# Altium schematic sheet eDP.SchDoc
size B
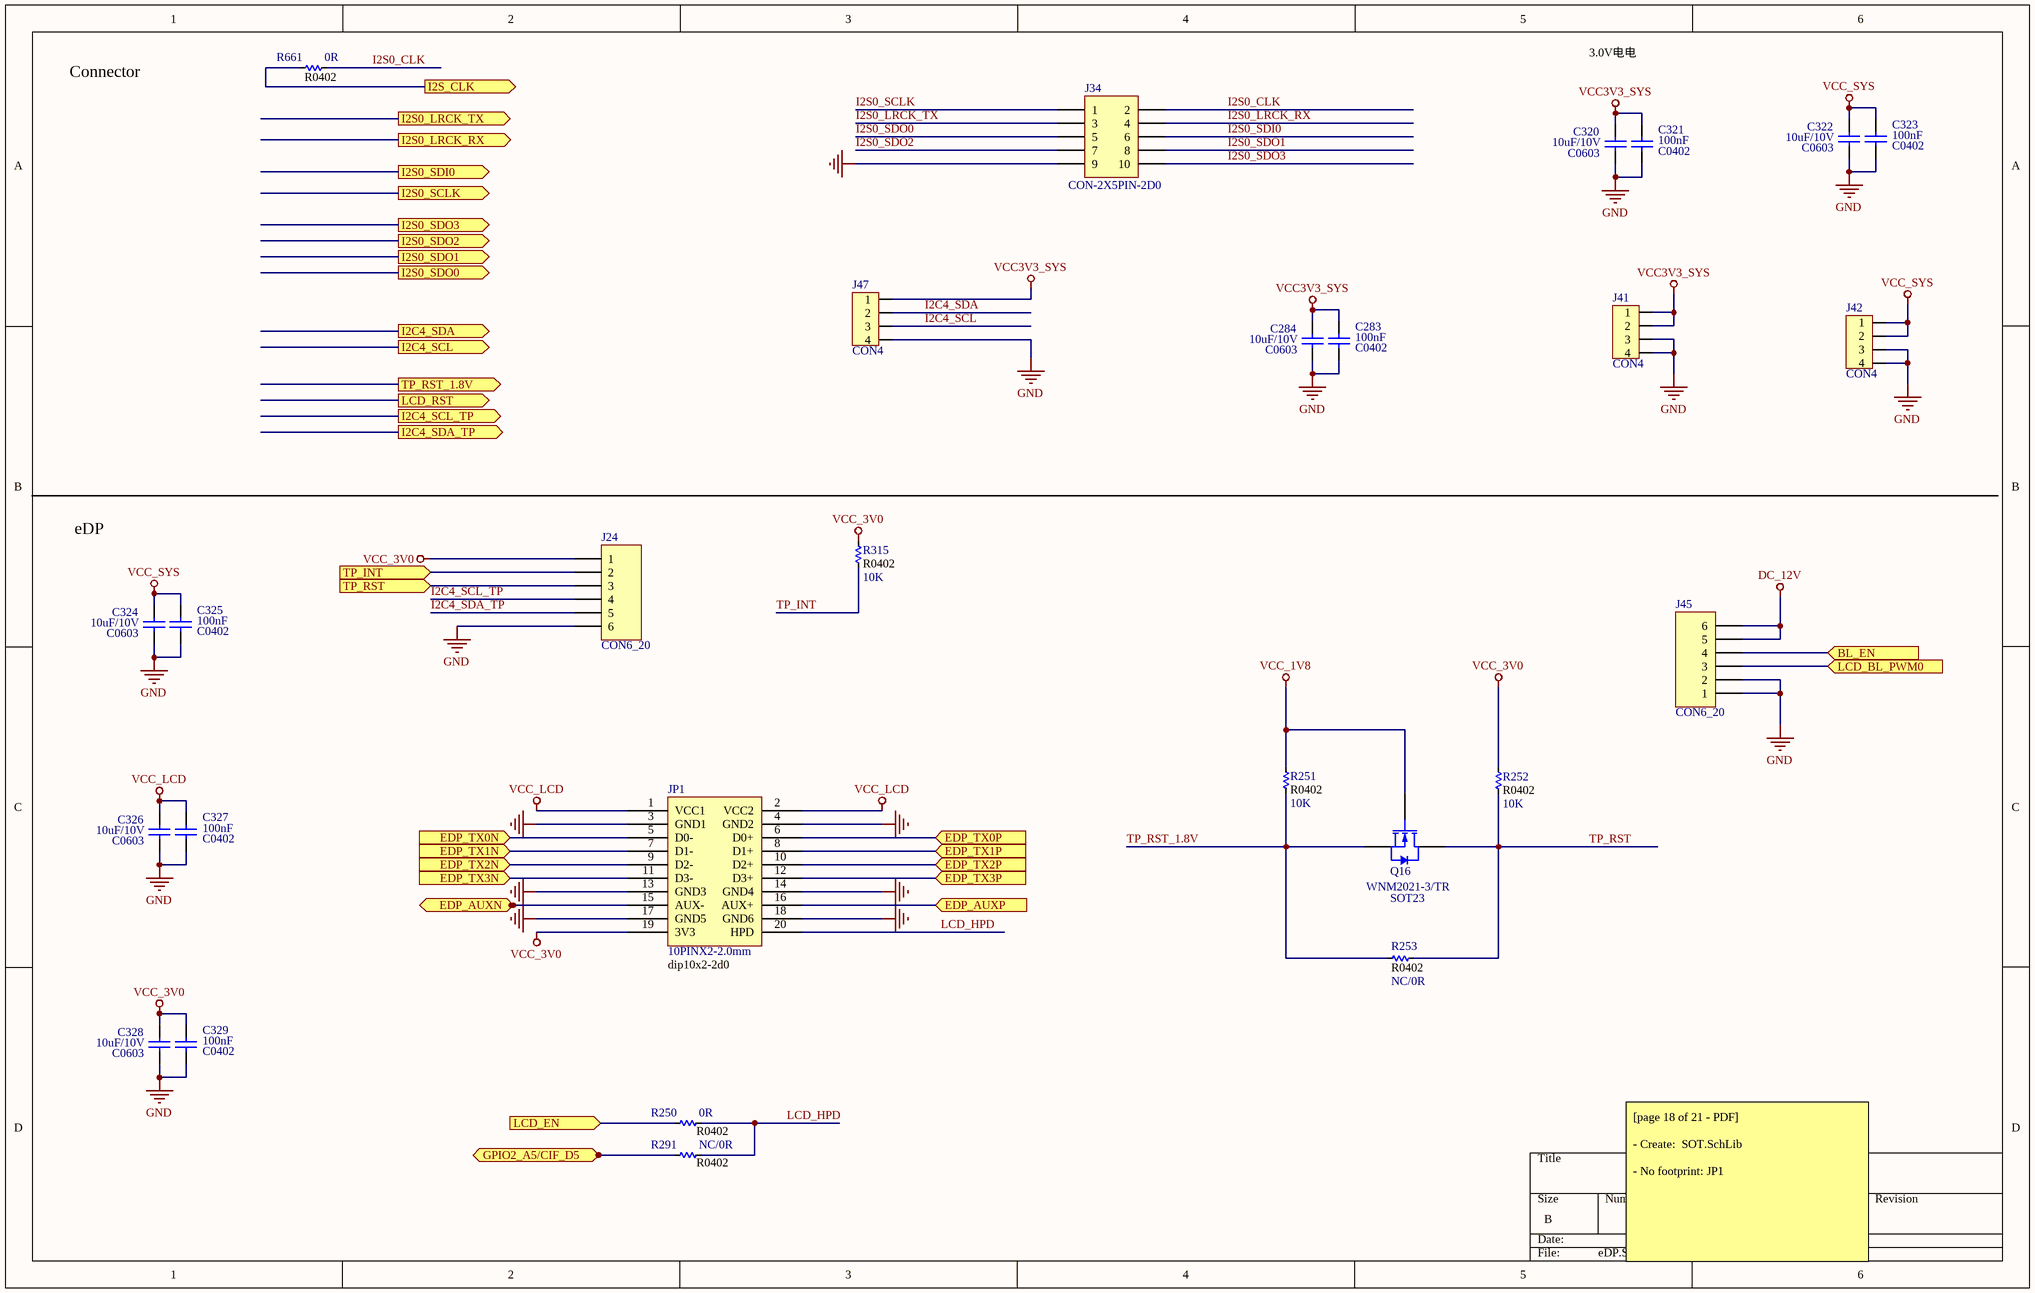
[diagram p0: eDP.SchDoc]

## Parts
C283  C0402  value 100nF  [C 0402]
C284  C0603  value 10uF/10V  [C 0603]
C320  C0603  value 10uF/10V  [C 0603]
C321  C0402  value 100nF  [C 0402]
C322  C0603  value 10uF/10V  [C 0603]
C323  C0402  value 100nF  [C 0402]
C324  C0603  value 10uF/10V  [C 0603]
C325  C0402  value 100nF  [C 0402]
C326  C0603  value 10uF/10V  [C 0603]
C327  C0402  value 100nF  [C 0402]
C328  C0603  value 10uF/10V  [C 0603]
C329  C0402  value 100nF  [C 0402]
J24  CON6_20  [Header6]
J34  CON-2X5PIN-2D0  [Hed2X5]
J41  CON4  [CON4]
J42  CON4  [CON4]
J45  CON6_20  [Header6]
J47  CON4  [CON4]
JP1  10PINX2-2.0mm  [JP10-D2T]
Q16  WNM2021-3/TR  [SOT23]
R250  R0402  value 0R  [R 0402]
R251  R0402  value 10K  [R 0402]
R252  R0402  value 10K  [R 0402]
R253  R0402  value NC/0R  [R 0402]
R291  R0402  value NC/0R  [R 0402]
R315  R0402  value 10K  [R 0402]
R661  R0402  value 0R  [R 0402]

## Ports
BL_EN (in), EDP_AUXN (in), EDP_AUXP (in), EDP_TX0N (in), EDP_TX0P (in), EDP_TX1N (in), EDP_TX1P (in), EDP_TX2N (in), EDP_TX2P (in), EDP_TX3N (in), EDP_TX3P (in), GPIO2_A5/CIF_D5 (in), I2C4_SCL (out), I2C4_SCL_TP (out), I2C4_SDA (out), I2C4_SDA_TP (out), I2S0_LRCK_RX (out), I2S0_LRCK_TX (out), I2S0_SCLK (out), I2S0_SDI0 (out), I2S0_SDO0 (out), I2S0_SDO1 (out), I2S0_SDO2 (out), I2S0_SDO3 (out), I2S_CLK (out), LCD_BL_PWM0 (in), LCD_EN (in), LCD_RST (out), TP_INT (in), TP_RST (in), TP_RST_1.8V (out)

## Nets
DC_12V: J45.5 J45.6
GND: C283.2 C284.2 C320.2 C321.2 C322.2 C323.2 C324.2 C325.2 C326.2 C327.2 C328.2 C329.2 J24.6 J34.9 J41.3 J41.4 J42.3 J42.4 J45.1 J45.2 J47.4 JP1.3(GND1) JP1.4(GND2) JP1.13(GND3) JP1.14(GND4) JP1.17(GND5) JP1.18(GND6)
VCC3V3_SYS: C283.1 C284.1 C320.1 C321.1 J41.1 J41.2 J47.1
VCC_1V8: Q16.3(G) R251.2
VCC_3V0: C328.1 C329.1 J24.1 JP1.19(3V3) R252.2 R315.2
VCC_LCD: C326.1 C327.1 JP1.1(VCC1) JP1.2(VCC2)
VCC_SYS: C322.1 C323.1 C324.1 C325.1 J42.1 J42.2
BL_EN: J45.4 ; port BL_EN
EDP_AUXN: JP1.15(AUX-) ; port EDP_AUXN
EDP_AUXP: JP1.16(AUX+) ; port EDP_AUXP
EDP_TX0N: JP1.5(D0-) ; port EDP_TX0N
EDP_TX0P: JP1.6(D0+) ; port EDP_TX0P
EDP_TX1N: JP1.7(D1-) ; port EDP_TX1N
EDP_TX1P: JP1.8(D1+) ; port EDP_TX1P
EDP_TX2N: JP1.9(D2-) ; port EDP_TX2N
EDP_TX2P: JP1.10(D2+) ; port EDP_TX2P
EDP_TX3N: JP1.11(D3-) ; port EDP_TX3N
EDP_TX3P: JP1.12(D3+) ; port EDP_TX3P
GPIO2_A5/CIF_D5: R291.1 ; port GPIO2_A5/CIF_D5
I2C4_SCL: J47.3
I2C4_SCL_TP: J24.4
I2C4_SDA: J47.2
I2C4_SDA_TP: J24.5
I2S0_CLK: J34.2 R661.2
I2S0_LRCK_RX: J34.4
I2S0_LRCK_TX: J34.3
I2S0_SCLK: J34.1
I2S0_SDI0: J34.6
I2S0_SDO0: J34.5
I2S0_SDO1: J34.8
I2S0_SDO2: J34.7
I2S0_SDO3: J34.10
I2S_CLK: R661.1 ; port I2S_CLK
LCD_BL_PWM0: J45.3 ; port LCD_BL_PWM0
LCD_EN: R250.1 ; port LCD_EN
LCD_HPD: JP1.20(HPD) R250.2 R291.2
TP_INT: J24.2 ; port TP_INT
TP_INT: R315.1  [a separate net that carries the same name]
TP_RST: J24.3 ; port TP_RST
TP_RST: Q16.1(D) R252.1 R253.1  [a separate net that carries the same name]
TP_RST_1.8V: Q16.2(S) R251.1 R253.2

## Notes on the sheet
- Connector
- 3.0V电电
- eDP
- [page 18 of 21 - PDF]
  - Create:  SOT.SchLib
  - No footprint: JP1
- (in symbol 10PINX2-2.0mm) dip10x2-2d0

## Library data of the parts
C283 C284 C320-C329 = Cap: Capacitor; Published: 8-Jun-2000; LatestRevisionDate: 17-Jul-2002; LatestRevisionNote: Re-released for DXP Platform.; PackageReference: RAD-0.3; Publisher: Altium Limited; PackageDescription: Radial Cap, Thru-Hole; 2 Leads; 0.3 in Pin Spacing
J24 J45 = Header 6: Header, 6-Pin; LatestRevisionDate: 17-Jul-2002; LatestRevisionNote: Re-released for DXP Platform.; Publisher: Altium Limited
J34 = Header 5X2: Header, 5-Pin, Dual row; LatestRevisionDate: 17-Jul-2002; LatestRevisionNote: Re-released for DXP Platform.; Publisher: Altium Limited
J41 J42 J47 = Header4: Header IDC, 4 x 1 Pin Vertical 2.54mm Pitch (Non-Boxed, Male); Manufacturer: W¨¹rth Elektronik eiSos GmbH; partNo: 613002143121; ComponentLink1 Description: Manufacturer; ComponentLink2 Description: Datasheet; NoPins: 02; Created Date: 29 March 2013; ComponentLink1URL: http://www.we-online.com; ComponentLink2URL: http://katalog.we-online.de/em/datasheet/6130xx143121.pdf; Created by: Karrer Zheng
Q16 = ZXM61N02F: 20V N-Channel Enhancement Mode MOSFET; Published: 17-Dec-2003; DatasheetVersion: May-99; PackageVersion: 1996; PackageReference: SOT23; Publisher: Altium Limited; PackageDescription: SOT-23; 3 Leads; Body 3.1 x 2.5 mm, inc. leads (LxW max), Alternate Lead Configuration; ComponentLink1Description: Manufacturer Link; ComponentLink1URL: http://www.zetex.com/; ComponentLink2Description: Datasheet; ComponentLink2URL: www.zetex.com/3.0/pdf/ZXM61N02F.pdf
R250-R253 R291 R315 R661 = Res-SMD: Resistor; Manufacturer: Generic Components; Class: Passive; Published: 08/06/2000; Publisher: Altium Hobart Technology Centre